# Altium schematic sheet Power.SchDoc
size A; SheetNumber: 2; SheetTotal: 8
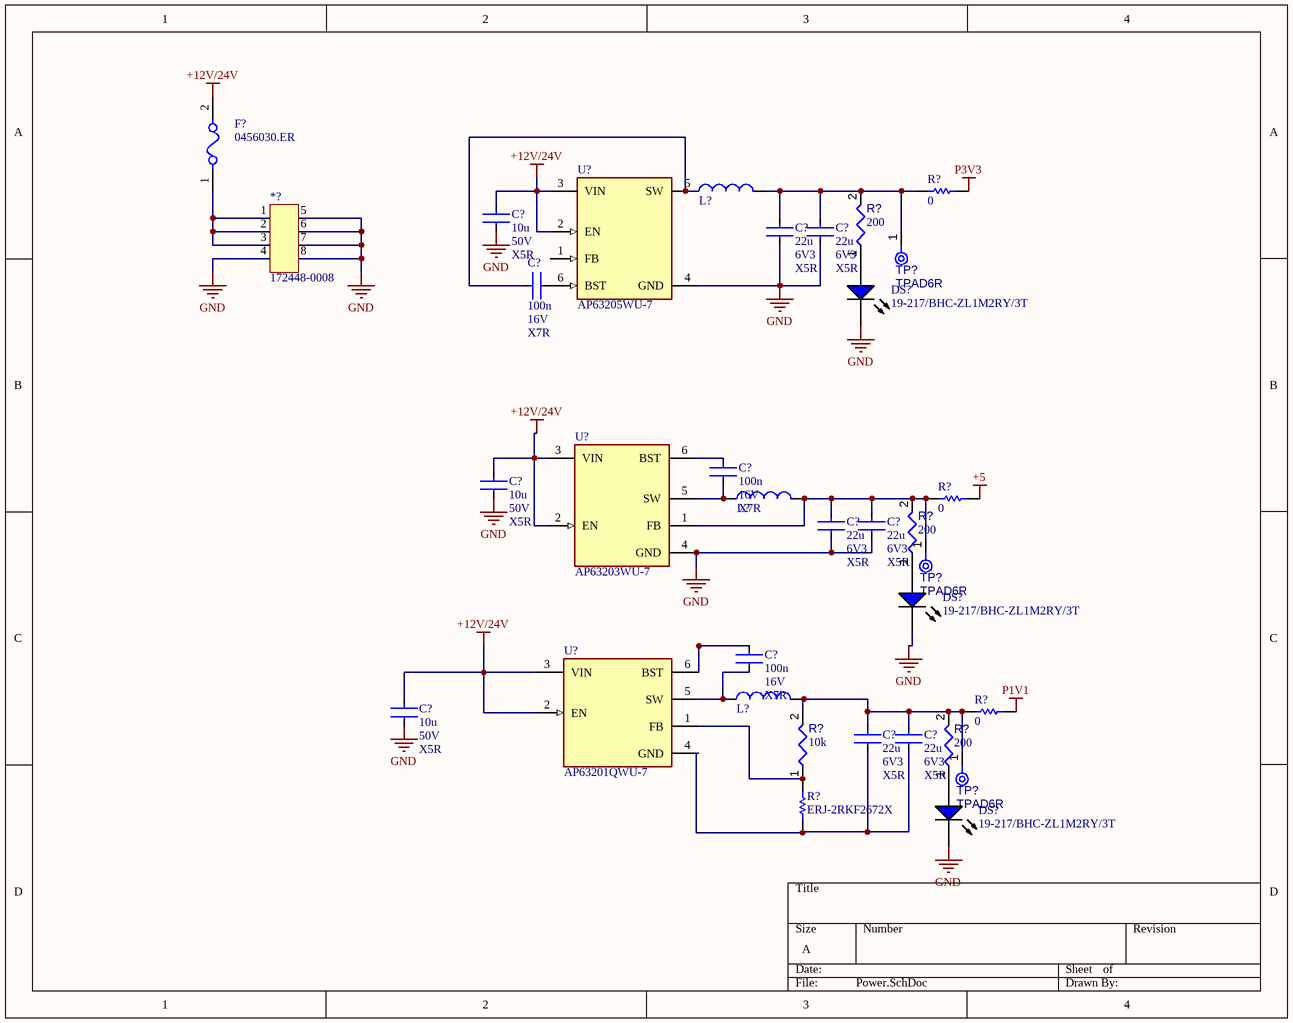
[diagram p0: Power.SchDoc]

## Parts
(Parts that share a designator on the sheet are numbered #1, #2 ... from top to bottom, then left to right.)
*?  172448-0008  [FP-172448-0008-MFG]
C?#1  value 10u  Voltage: 50V  Dielectric: X5R  [CAPC3225X18N]  (hidden comment: 10uF 50V 1210 X5R)
C?#2  value 22u  Voltage: 6V3  Dielectric: X5R  [CAPC1608X08N]  (hidden comment: 22uF 6.3V 0603)
C?#3  value 22u  Voltage: 6V3  Dielectric: X5R  [CAPC1608X08N]  (hidden comment: 22uF 6.3V 0603)
C?#4  value 100n  Voltage: 16V  Dielectric: X7R  [CAPC1005X06N]  (hidden comment: 100nF 16V 0402)
C?#5  value 100n  Voltage: 16V  Dielectric: X7R  [CAPC1005X06N]  (hidden comment: 100nF 16V 0402)
C?#6  value 10u  Voltage: 50V  Dielectric: X5R  [CAPC3225X18N]  (hidden comment: 10uF 50V 1210 X5R)
C?#7  value 22u  Voltage: 6V3  Dielectric: X5R  [CAPC1608X08N]  (hidden comment: 22uF 6.3V 0603)
C?#8  value 22u  Voltage: 6V3  Dielectric: X5R  [CAPC1608X08N]  (hidden comment: 22uF 6.3V 0603)
C?#9  value 100n  Voltage: 16V  Dielectric: X7R  [CAPC1005X06N]  (hidden comment: 100nF 16V 0402)
C?#10  value 10u  Voltage: 50V  Dielectric: X5R  [CAPC3225X18N]  (hidden comment: 10uF 50V 1210 X5R)
C?#11  value 22u  Voltage: 6V3  Dielectric: X5R  [CAPC1608X08N]  (hidden comment: 22uF 6.3V 0603)
C?#12  value 22u  Voltage: 6V3  Dielectric: X5R  [CAPC1608X08N]  (hidden comment: 22uF 6.3V 0603)
DS?#1  19-217/BHC-ZL1M2RY/3T  [EVRL-0603-2_V]
DS?#2  19-217/BHC-ZL1M2RY/3T  [EVRL-0603-2_V]
DS?#3  19-217/BHC-ZL1M2RY/3T  [EVRL-0603-2_V]
F?  0456030.ER  [FP-0456-IPC_B]
L?#1  74439358047  [74439358047-Footprint-1]  (value not drawn)
L?#2  74439358047  [74439358047-Footprint-1]  (value not drawn)
L?#3  74439358047  [74439358047-Footprint-1]  (value not drawn)
R?#1  value 0  [RESC1608X55X25ML10T15]  (hidden comment: Resistor 0R +/- 5% 0603 100 mW)
R?#2  value 200  [RESC0402(1005)_L]  (hidden comment: 200R2J)
R?#3  value 0  [RESC1608X55X25ML10T15]  (hidden comment: Resistor 0R +/- 5% 0603 100 mW)
R?#4  value 200  [RESC0402(1005)_L]  (hidden comment: 200R2J)
R?#5  value 0  [RESC1608X55X25ML10T15]  (hidden comment: Resistor 0R +/- 5% 0603 100 mW)
R?#6  value 10k  [RESC0402(1005)_L]  (hidden comment: 10KR2F)
R?#7  value 200  [RESC0402(1005)_L]  (hidden comment: 200R2J)
R?#8  ERJ-2RKF2672X  [RESC1005X40X25NL05T05]
TP?#1  TPAD6R  [TP06R]  (no BOM)
TP?#2  TPAD6R  [TP06R]  (no BOM)
TP?#3  TPAD6R  [TP06R]  (no BOM)
U?#1  AP63205WU-7  [FP-TSOT26-IPC_B]
U?#2  AP63203WU-7  [FP-TSOT26-IPC_B]
U?#3  AP63201QWU-7  [FP-TSOT26-IPC_B]

## Nets
+5: R?#3.2
+12V/24V: C?#1.1 C?#6.1 C?#10.1 F?.2 U?#1.2(EN) U?#1.3(VIN) U?#2.2(EN) U?#2.3(VIN) U?#3.2(EN) U?#3.3(VIN)
GND: *?.4 *?.5 *?.6 *?.7 *?.8 C?#1.2 C?#2.2 C?#3.2 C?#6.2 C?#7.2 C?#8.2 C?#10.2 DS?#1.2(K) DS?#2.2(K) DS?#3.2(K) U?#1.4(GND) U?#2.4(GND)
P1V1: R?#5.2
P3V3: R?#1.2
Net*?_1: *?.1 *?.2 *?.3 F?.1
NetC?#2_1: C?#2.1 C?#3.1 L?#1.2 R?#1.1 R?#2.2 TP?#1.1(TP)
NetC?#4_1: C?#4.1 L?#1.1 U?#1.5(SW)
NetC?#4_2: C?#4.2 U?#1.6(BST)
NetC?#5_1: C?#5.1 U?#2.6(BST)
NetC?#5_2: C?#5.2 L?#2.1 U?#2.5(SW)
NetC?#7_1: C?#7.1 C?#8.1 L?#2.2 R?#3.1 R?#4.2 TP?#2.1(TP) U?#2.1(FB)
NetC?#9_1: C?#9.1 U?#3.6(BST)
NetC?#9_2: C?#9.2 L?#3.1 U?#3.5(SW)
NetC?#11_1: C?#11.1 C?#12.1 L?#3.2 R?#5.1 R?#6.2 R?#7.2 TP?#3.1(TP)
NetC?#11_2: C?#11.2 C?#12.2 R?#8.1 U?#3.4(GND)
NetDS?#1_1: DS?#1.1(A) R?#2.1
NetDS?#2_1: DS?#2.1(A) R?#4.1
NetDS?#3_1: DS?#3.1(A) R?#7.1
NetR?#6_1: R?#6.1 R?#8.2 U?#3.1(FB)

Not connected (* = marked no-connect by the designer): U?#1 1(FB)

## Library data of the parts
*? = CMP-002-00125-1: Rectangular Power Connector, 8 Contact(s), Male, Solder Terminal; Connector Type: Power,Rectangular; Mounting Technology: Board; RoHS Compliant: Yes
C?#1 C?#6 C?#10 = CMP-001-00097-2: 35V 10uF X5R ±10% 1210 Multilayer Ceramic Capacitors MLCC - SMD/SMT ROHS; Footprint: 1210; LCSC Part #: C92799
C?#2 C?#3 C?#7 C?#8 C?#11 C?#12 = CMP-001-00086-2: 6.3V 22uF X5R ±20% 0603 Multilayer Ceramic Capacitors MLCC - SMD/SMT ROHS; LCSC Part #: C59461; Package: 0603
C?#4 C?#5 C?#9 = CMP-001-00088-2: 16V 100nF X7R ±10% 0402 Multilayer Ceramic Capacitors MLCC - SMD/SMT ROHS; LCSC Part #: C1525; Package: 0402
DS?#1-DS?#3 = CMP-007-00003-1: Chip LED, Blue, 5 V, 25 mA, -40 to 85 degC, 2-Pin SMD (0603), RoHS, Tape and Reel; Manufacturer: Everlight Electronics; Luminous Intensity: 28.5mcd; Forward Voltage: 3V; Forward Current: 25mA; Viewing Angle: 120degrees; Lens Style: Diffused; Packaging: TapeandReel; Mounting Technology: SM; Manufacturer URL: http://www.everlight.com/; Colour: Blue; Max Operating Temperature: 85°C; Datasheet Version: Rev. 1.0, 03/2003; Package Description: 2-Pin Surface Mount Device, Body 1.6 x 0.8 mm; RoHS Compliant: True; Package Reference: 0603; Pins: 2; Min Operating Temperature: -40°C; Case/Package: 0603; Datasheet URL: https://datasheet.ciiva.com/26901/getdatasheetpartid-420616-26901324.pdf
F? = CMP-005-00014-1: Electric Fuse, Very Fast Blow, 30A, 125VAC, 72VDC, 100A (IR), Surface Mount, NANO; Current Rating: 30A; Max Operating Temperature: 125°C; Mounting Technology: Surface Mount; RoHS Compliant: Yes; Min Operating Temperature: -55°C
L?#1-L?#3 = CMP-006-00021-1: Fixed Ind 4.7UH 9.5A 8.65 Mohm
R?#1 R?#3 R?#5 = CMP-009-00006-4: Chip Resistor, 0 Ohm, 0.1 W, -55 to 155 degC, 0603 (1608 Metric); Power: 100mW; Voltage Rating: 50V; Pins: 2; Mounting Technology: SM; Case/Package: 0603; Max Operating Temperature: 155°C; RoHS Compliant: True; Min Operating Temperature: -55°C; Tolerance: 5%
R?#2 R?#4 R?#7 = CMP-009-00079-3: 200R 0.063W 5% 0402 (1005 Metric)  SMD; Power: 63mW; Tolerance: 5%; Case/Package: 0402; Mounting Technology: SMT; Pins: 2
R?#6 = CMP-009-00066-3: 10K 0.063W 1% 0402 (1005 Metric)  SMD; Power: 63mW; Tolerance: 1%; Case/Package: 0402; Mounting Technology: SMT; Pins: 2
R?#8 = CMP-2002-00822-1: Manufacturer: Panasonic; Part Number: ERJ-2RKF2672X
TP?#1-TP?#3 = CMP-00028-00002-1: 0.6mm round; Pins: 1
U?#1 = CMP-019-00066-1: Switching Regulator
U?#2 = CMP-019-00065-1: Switching Regulator
U?#3 = CMP-019-00067-1: Switching Regulator